# EAGLE design Callisto_MSO_Teknic_4BPico (EAGLE 9.6.2)
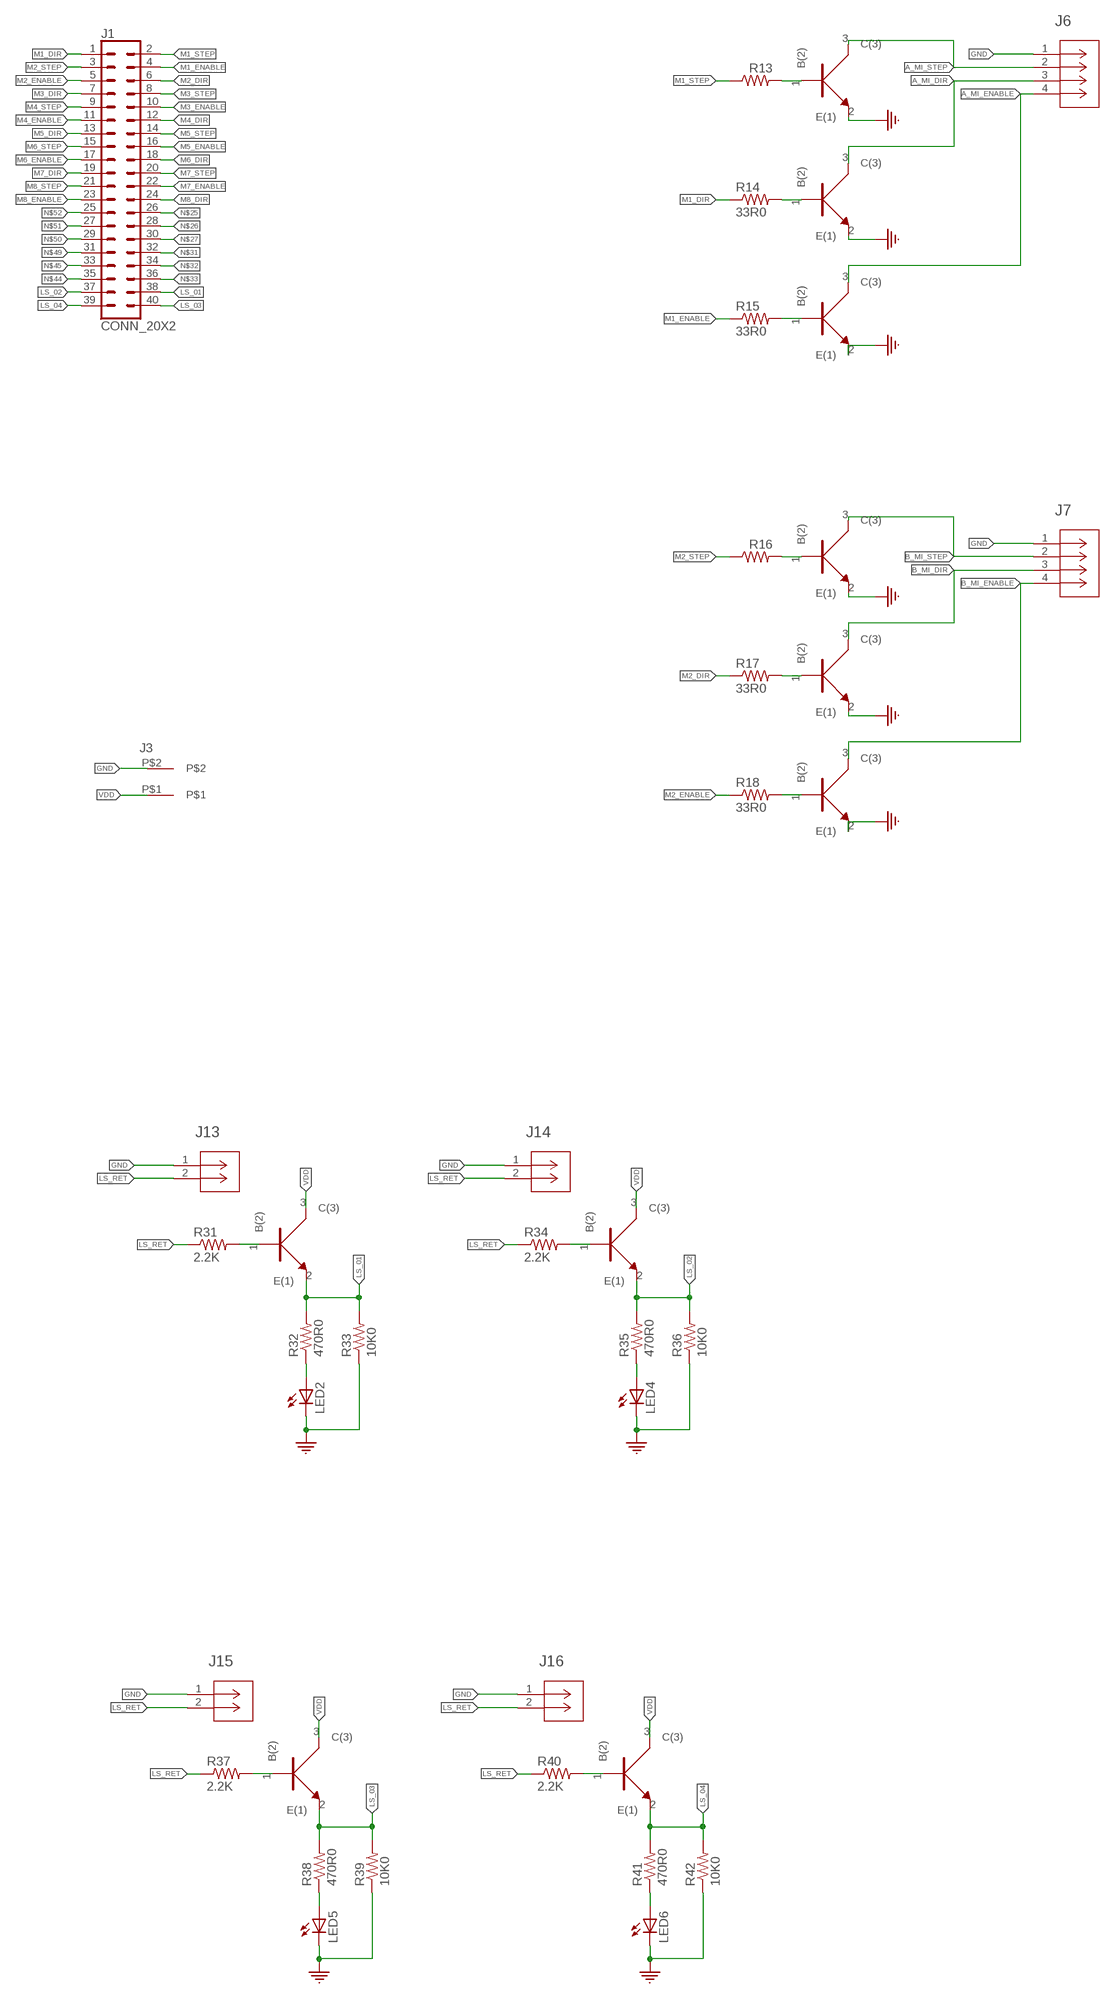
[diagram p0: schematic, sheet 1, part 1 of 2]
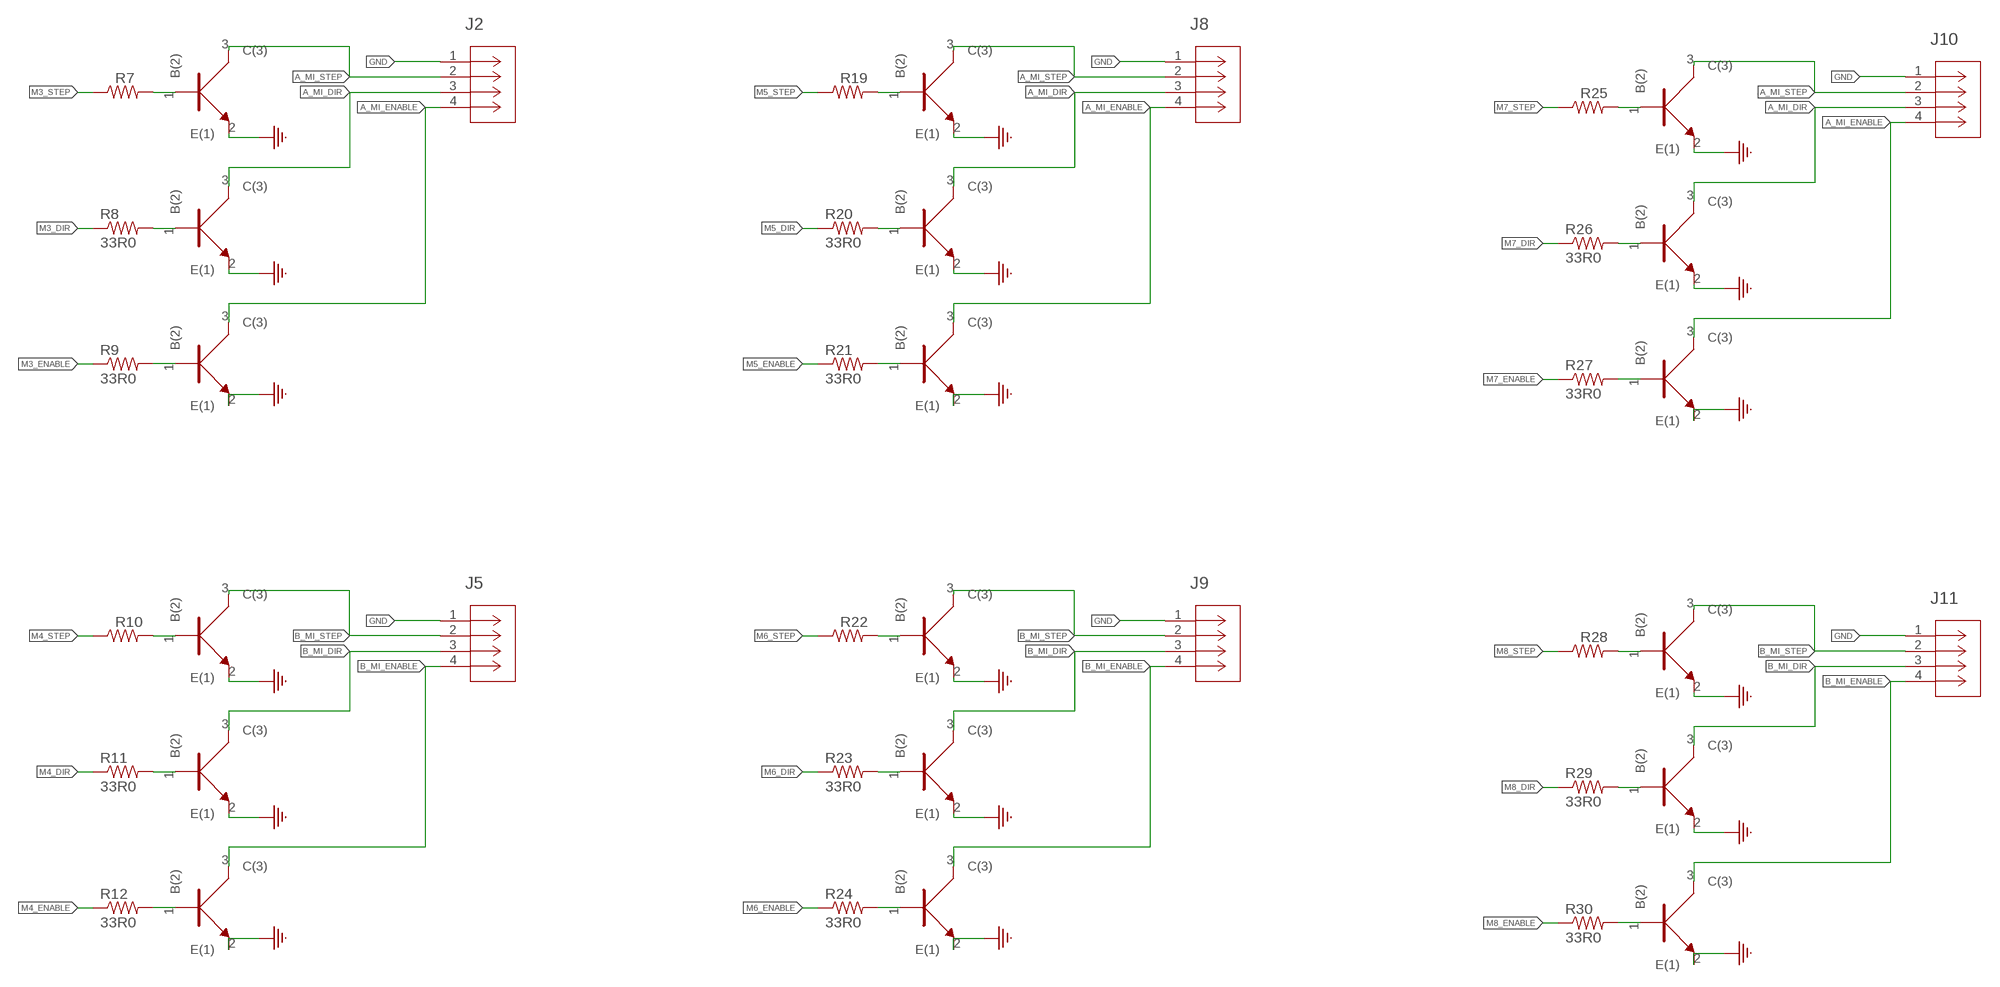
[diagram p1: schematic, sheet 1, part 2 of 2]

## Parts
J1  CONN_20X2  [2X20]
J2  CONN_530470410_PICOBLADE_X_4  [CON_530470410_MOL]
J3  2-pos  3.81MM_1_X_2_RT_ANGLE_PLUG_HEADER  [2_3.81MM_PITCH]
J5  CONN_530470410_PICOBLADE_X_4  [CON_530470410_MOL]
J6  CONN_530470410_PICOBLADE_X_4  [CON_530470410_MOL]
J7  CONN_530470410_PICOBLADE_X_4  [CON_530470410_MOL]
J8  CONN_530470410_PICOBLADE_X_4  [CON_530470410_MOL]
J9  CONN_530470410_PICOBLADE_X_4  [CON_530470410_MOL]
J10  CONN_530470410_PICOBLADE_X_4  [CON_530470410_MOL]
J11  CONN_530470410_PICOBLADE_X_4  [CON_530470410_MOL]
J13  CONN_530470210_PICOBLADE_X_2  [CON_530470210_MOL]
J14  CONN_530470210_PICOBLADE_X_2  [CON_530470210_MOL]
J15  CONN_530470210_PICOBLADE_X_2  [CON_530470210_MOL]
J16  CONN_530470210_PICOBLADE_X_2  [CON_530470210_MOL]
LED2  Green  LED_0805_GREEN  [0805]
LED4  Green  LED_0805_GREEN  [0805]
LED5  Green  LED_0805_GREEN  [0805]
LED6  Green  LED_0805_GREEN  [0805]
R7  33R0  R_0402_33R0  [0402]
R8  33R0  R_0402_33R0  [0402]
R9  33R0  R_0402_33R0  [0402]
R10  33R0  R_0402_33R0  [0402]
R11  33R0  R_0402_33R0  [0402]
R12  33R0  R_0402_33R0  [0402]
R13  33R0  R_0402_33R0  [0402]
R14  33R0  R_0402_33R0  [0402]
R15  33R0  R_0402_33R0  [0402]
R16  33R0  R_0402_33R0  [0402]
R17  33R0  R_0402_33R0  [0402]
R18  33R0  R_0402_33R0  [0402]
R19  33R0  R_0402_33R0  [0402]
R20  33R0  R_0402_33R0  [0402]
R21  33R0  R_0402_33R0  [0402]
R22  33R0  R_0402_33R0  [0402]
R23  33R0  R_0402_33R0  [0402]
R24  33R0  R_0402_33R0  [0402]
R25  33R0  R_0402_33R0  [0402]
R26  33R0  R_0402_33R0  [0402]
R27  33R0  R_0402_33R0  [0402]
R28  33R0  R_0402_33R0  [0402]
R29  33R0  R_0402_33R0  [0402]
R30  33R0  R_0402_33R0  [0402]
R31  2.2K  R_0402  [0402]
R32  470R0  R_0402_470R0  [0402]
R33  10K0  R_0402_10K0  [0402]
R34  2.2K  R_0402  [0402]
R35  470R0  R_0402_470R0  [0402]
R36  10K0  R_0402_10K0  [0402]
R37  2.2K  R_0402  [0402]
R38  470R0  R_0402_470R0  [0402]
R39  10K0  R_0402_10K0  [0402]
R40  2.2K  R_0402  [0402]
R41  470R0  R_0402_470R0  [0402]
R42  10K0  R_0402_10K0  [0402]
U2  NPN  BC846BW  [SOT323]
U4  NPN  BC846BW  [SOT323]
U5  NPN  BC846BW  [SOT323]
U6  NPN  BC846BW  [SOT323]
U7  NPN  BC846BW  [SOT323]
U8  NPN  BC846BW  [SOT323]
U9  NPN  BC846BW  [SOT323]
U10  NPN  BC846BW  [SOT323]
U11  NPN  BC846BW  [SOT323]
U12  NPN  BC846BW  [SOT323]
U13  NPN  BC846BW  [SOT323]
U14  NPN  BC846BW  [SOT323]
U15  NPN  BC846BW  [SOT323]
U16  NPN  BC846BW  [SOT323]
U17  NPN  BC846BW  [SOT323]
U18  NPN  BC846BW  [SOT323]
U19  NPN  BC846BW  [SOT323]
U20  NPN  BC846BW  [SOT323]
U21  NPN  BC846BW  [SOT323]
U22  NPN  BC846BW  [SOT323]
U23  NPN  BC846BW  [SOT323]
U24  NPN  BC846BW  [SOT323]
U25  NPN  BC846BW  [SOT323]
U26  NPN  BC846BW  [SOT323]
U27  NPN  BC846BW  [SOT323]
U28  NPN  BC846BW  [SOT323]
U29  NPN  BC846BW  [SOT323]
U30  NPN  BC846BW  [SOT323]

## Nets
A_MI_DIR: J2.3 J6.3 J8.3 J10.3 U8.3(C(3)) U14.3(C(3)) U20.3(C(3)) U26.3(C(3))
A_MI_ENABLE: J2.4 J6.4 J8.4 J10.4 U9.3(C(3)) U15.3(C(3)) U21.3(C(3)) U27.3(C(3))
A_MI_STEP: J2.2 J6.2 J8.2 J10.2 U7.3(C(3)) U13.3(C(3)) U19.3(C(3)) U25.3(C(3))
B_MI_DIR: J5.3 J7.3 J9.3 J11.3 U11.3(C(3)) U17.3(C(3)) U23.3(C(3)) U29.3(C(3))
B_MI_ENABLE: J5.4 J7.4 J9.4 J11.4 U12.3(C(3)) U18.3(C(3)) U24.3(C(3)) U30.3(C(3))
B_MI_STEP: J5.2 J7.2 J9.2 J11.2 U10.3(C(3)) U16.3(C(3)) U22.3(C(3)) U28.3(C(3))
GND: J2.1 J3.P$2 J5.1 J6.1 J7.1 J8.1 J9.1 J10.1 J11.1 J13.1 J14.1 J15.1 J16.1 LED2.2(C) LED4.2(C) LED5.2(C) LED6.2(C) R33.P$1 R36.P$1 R39.P$1 R42.P$1 U7.2(E(1)) U8.2(E(1)) U9.2(E(1)) U10.2(E(1)) U11.2(E(1)) U12.2(E(1)) U13.2(E(1)) U14.2(E(1)) U15.2(E(1)) U16.2(E(1)) U17.2(E(1)) U18.2(E(1)) U19.2(E(1)) U20.2(E(1)) U21.2(E(1)) U22.2(E(1)) U23.2(E(1)) U24.2(E(1)) U25.2(E(1)) U26.2(E(1)) U27.2(E(1)) U28.2(E(1)) U29.2(E(1)) U30.2(E(1))
LS_01: J1.38 R32.P$2 R33.P$2 U2.2(E(1))
LS_02: J1.37 R35.P$2 R36.P$2 U4.2(E(1))
LS_03: J1.40 R38.P$2 R39.P$2 U5.2(E(1))
LS_04: J1.39 R41.P$2 R42.P$2 U6.2(E(1))
LS_RET: J13.2 J14.2 J15.2 J16.2 R31.P$1 R34.P$1 R37.P$1 R40.P$1
M1_DIR: J1.1 R14.P$1
M1_ENABLE: J1.4 R15.P$1
M1_STEP: J1.2 R13.P$1
M2_DIR: J1.6 R17.P$1
M2_ENABLE: J1.5 R18.P$1
M2_STEP: J1.3 R16.P$1
M3_DIR: J1.7 R8.P$1
M3_ENABLE: J1.10 R9.P$1
M3_STEP: J1.8 R7.P$1
M4_DIR: J1.12 R11.P$1
M4_ENABLE: J1.11 R12.P$1
M4_STEP: J1.9 R10.P$1
M5_DIR: J1.13 R20.P$1
M5_ENABLE: J1.16 R21.P$1
M5_STEP: J1.14 R19.P$1
M6_DIR: J1.18 R23.P$1
M6_ENABLE: J1.17 R24.P$1
M6_STEP: J1.15 R22.P$1
M7_DIR: J1.19 R26.P$1
M7_ENABLE: J1.22 R27.P$1
M7_STEP: J1.20 R25.P$1
M8_DIR: J1.24 R29.P$1
M8_ENABLE: J1.23 R30.P$1
M8_STEP: J1.21 R28.P$1
N$3: R8.P$2 U8.1(B(2))
N$5: R9.P$2 U9.1(B(2))
N$6: R7.P$2 U7.1(B(2))
N$8: R31.P$2 U2.1(B(2))
N$9: LED2.1(A) R32.P$1
N$10: R11.P$2 U11.1(B(2))
N$11: R12.P$2 U12.1(B(2))
N$12: R10.P$2 U10.1(B(2))
N$13: R14.P$2 U14.1(B(2))
N$14: R15.P$2 U15.1(B(2))
N$15: R13.P$2 U13.1(B(2))
N$16: R17.P$2 U17.1(B(2))
N$17: R18.P$2 U18.1(B(2))
N$18: R16.P$2 U16.1(B(2))
N$19: R20.P$2 U20.1(B(2))
N$20: R21.P$2 U21.1(B(2))
N$21: R19.P$2 U19.1(B(2))
N$22: R23.P$2 U23.1(B(2))
N$23: R24.P$2 U24.1(B(2))
N$24: R22.P$2 U22.1(B(2))
N$25: J1.26
N$26: J1.28
N$27: J1.30
N$28: R26.P$2 U26.1(B(2))
N$29: R27.P$2 U27.1(B(2))
N$30: R25.P$2 U25.1(B(2))
N$31: J1.32
N$32: J1.34
N$33: J1.36
N$34: R29.P$2 U29.1(B(2))
N$35: R30.P$2 U30.1(B(2))
N$36: R28.P$2 U28.1(B(2))
N$40: R34.P$2 U4.1(B(2))
N$41: LED4.1(A) R35.P$1
N$42: R37.P$2 U5.1(B(2))
N$44: J1.35
N$45: J1.33
N$46: LED5.1(A) R38.P$1
N$47: R40.P$2 U6.1(B(2))
N$48: LED6.1(A) R41.P$1
N$49: J1.31
N$50: J1.29
N$51: J1.27
N$52: J1.25
VDD: J3.P$1 U2.3(C(3)) U4.3(C(3)) U5.3(C(3)) U6.3(C(3))

## Library data of the parts
J1 = 3D_MIG_Controller:CONN_20X2: Multi connection point. Often used as Generic Header-pin footprint for 0.1 inch spaced/style header connections On any of the 0.1 inch spaced packages, you can populate with these: Break Away Headers - Straight <https://www.sparkfun.com/products/116> (PRT-00116) Break Away Male Headers - Right Angle <https://www.sparkfun.com/products/553> (PRT-00553) Female Headers <https://www.sparkfun.com/products/115> (PRT-00115) Break Away Headers - Machine Pin <https://www.sparkfun.com/products/117> (PRT-00117) Break Away Female Headers - Swiss Machine Pin <https://www.sparkfun.com/products/743> (PRT-00743)
J2 J5-J11 = 3D_MIG_Controller:CONN_530470410_PICOBLADE_X_4; COPYRIGHT: Copyright (C) 2022 Ultra Librarian. All rights reserved.; MANUFACTURER_PART_NUMBER: 530470410; MFR_NAME: Molex Connector Corporation
J3 = 3D_MIG_Controller:3.81MM_1_X_2_RT_ANGLE_PLUG_HEADER: TERM BLOCK HDR 2POS 90DEG 3.81MM; PARTNO: 691322310002
J13-J16 = 3D_MIG_Controller:CONN_530470210_PICOBLADE_X_2; COPYRIGHT: Copyright (C) 2022 Ultra Librarian. All rights reserved.; MANUFACTURER_PART_NUMBER: 530470210; MFR_NAME: Molex Connector Corporation
LED2 LED4-LED6 = 3D_MIG_Controller:LED_0805_GREEN: Green 570nm LED Indication - Discrete 2.2V 0805 (2012 Metric); PARTNO: LG R971-KN-1
R7-R30 = 3D_MIG_Controller:R_0402_33R0; PARTNO: RMCF0402JT33R0
R31 R34 R37 R40 = 3D_MIG_Controller:R_0402
R32 R35 R38 R41 = 3D_MIG_Controller:R_0402_470R0; PARTNO: RMCF0402JT470R
R33 R36 R39 R42 = 3D_MIG_Controller:R_0402_10K0; PARTNO: RMCF0402JT10K0
U2 U4-U30 = 3D_MIG_Controller:BC846BW: Bipolar (BJT) Transistor NPN 100MHz Surface Mount SOT-323; PARTNO: BC846BW_NPN

## Board
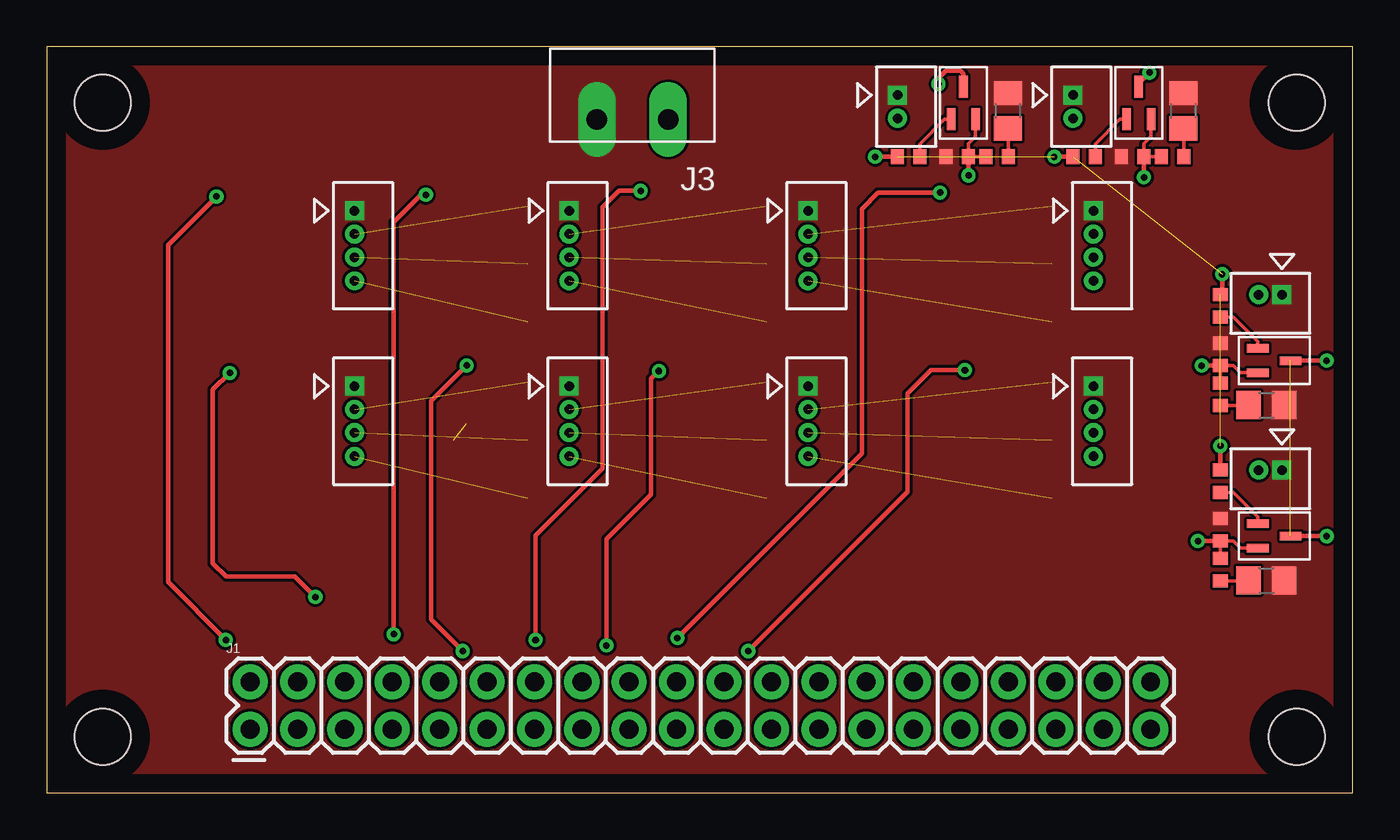
[diagram p2: board, top side]
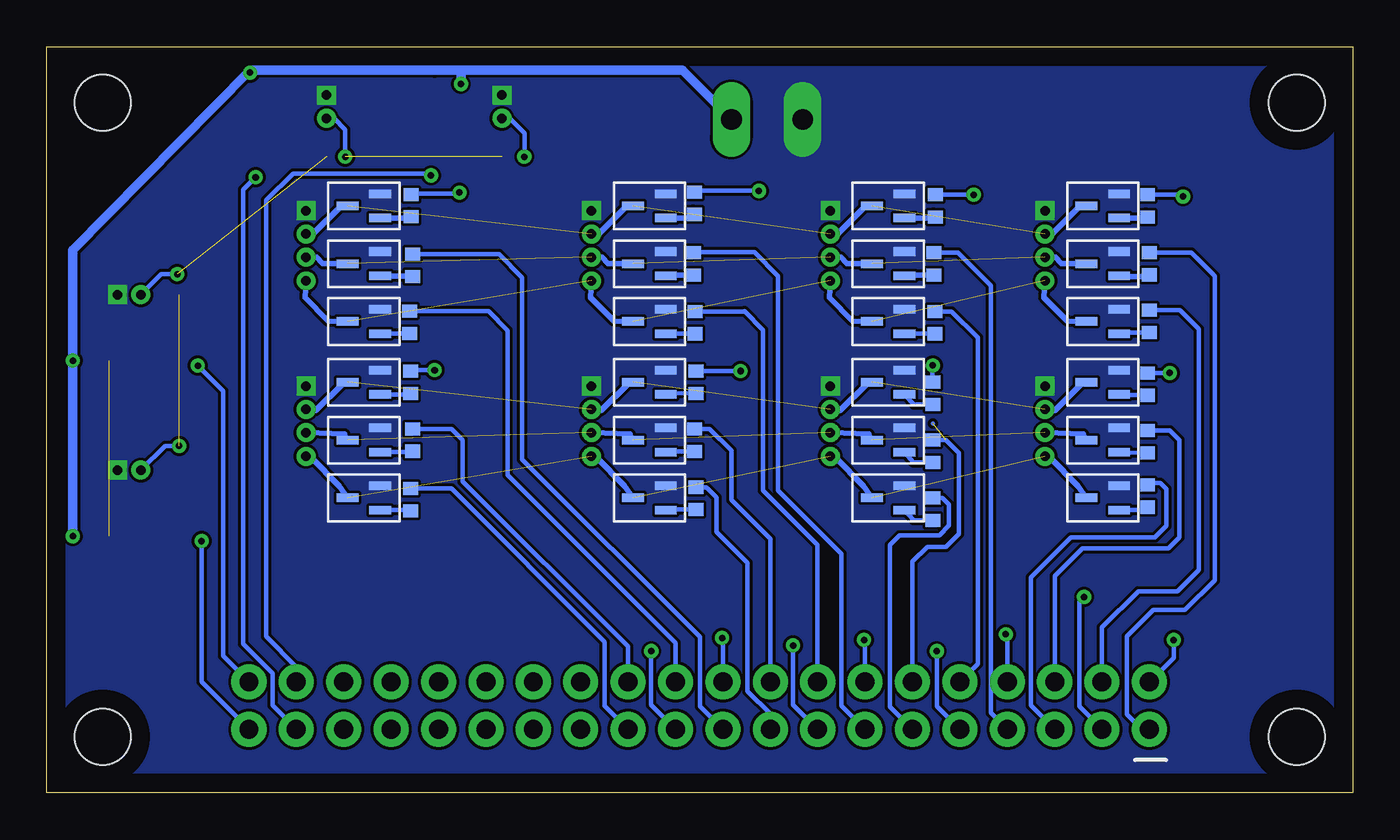
[diagram p3: board, bottom side, seen from below]

Size 70 x 40 mm. Coordinates in mm from the lower left corner, seen from the top.
Outline: 0,0 70,0 70,40 0,40 0,0
Copper layers (1*16): Top 0.035mm / dielectric 1.5mm / Bottom 0.035mm
Design rules "default": minimum track width 6mil, minimum drill 0.35mm, track to track 6mil, track to pad 6mil, pad to pad 6mil, via to via 6mil, smd to smd 6mil, copper to edge 40mil, drill to drill 6mil, minimum pad ring 10mil, minimum via ring 8mil, stop-mask expansion 4mil, vias tented up to drill 0mil, thermal gap 10mil
Holes 3 mm at 3,37 67,37 67,3 3,3

### Footprints (pad centres in the part's own frame; a part is rotated, then mirrored left to right if it is on the bottom)
2X20 = drill 1.016 pad 1.88: 1 0,0; 2 0,2.54; 3 2.54,0; 4 2.54,2.54; 5 5.08,0; 6 5.08,2.54; 7 7.62,0; 8 7.62,2.54; 9 10.16,0; 10 10.16,2.54; 11 12.7,0; 12 12.7,2.54; 13 15.24,0; 14 15.24,2.54; 15 17.78,0; 16 17.78,2.54; 17 20.32,0; 18 20.32,2.54; 19 22.86,0; 20 22.86,2.54; 21 25.4,0; 22 25.4,2.54; 23 27.94,0; 24 27.94,2.54; 25 30.48,0; 26 30.48,2.54; 27 33.02,0; 28 33.02,2.54; 29 35.56,0; 30 35.56,2.54; 31 38.1,0; 32 38.1,2.54; 33 40.64,0; 34 40.64,2.54; 35 43.18,0; 36 43.18,2.54; 37 45.72,0; 38 45.72,2.54; 39 48.26,0; 40 48.26,2.54
CON_530470410_MOL = drill 0.508 pad 0.838 square: 1 0,0 | drill 0.508 pad 0.838: 2 -1.245,0; 3 -2.489,0; 4 -3.759,0
2_3.81MM_PITCH = drill 1.1 pad 2 long: P$1 0,0; P$2 3.81,0
CON_530470210_MOL = drill 0.508 pad 0.838 square: 1 0,0 | drill 0.508 pad 0.838: 2 -1.245,0
0805 = smd 1.3 x 1.5: 1 -0.95,0; 2 0.95,0
0402 = smd 0.8 x 0.7: P$1 0,0.6; P$2 0,-0.6
SOT323 = smd 0.457 x 1.168: 1 -0.65,-0.876; 2 0.65,-0.876; 3 0,0.876

### Placement (x,y rotation side)
J1  10.9,3.41 0 top
J2  28,31.21 90 top
J3  33.3,36.1 180 top
J5  28,21.8 90 top
J6  16.5,31.21 90 top
J7  16.5,21.8 90 top
J8  40.8,31.21 90 top
J9  40.8,21.8 90 top
J10  56.1,31.21 90 top
J11  56.1,21.8 90 top
J13  45.6,37.4 90 top
J14  55,37.4 90 top
J15  66.2,26.7 0 top
J16  66.2,17.3 0 top
LED2  51.52,36.56 90 top
LED4  60.92,36.56 90 top
LED5  65.36,20.78 0 top
LED6  65.36,11.38 0 top
R7  22.37,31.46 0 bottom
R8  22.45,28.36 0 bottom
R9  22.4,25.21 0 bottom
R10  22.5,21.41 0 bottom
R11  22.5,18.31 0 bottom
R12  22.5,15.21 0 bottom
R13  11,31.47 0 bottom
R14  10.9,28.37 0 bottom
R15  10.9,25.27 0 bottom
R16  11,21.91 0 bottom
R17  11,18.82 0 bottom
R18  11,15.91 0 bottom
R19  35.27,31.61 0 bottom
R20  35.33,28.35 0 bottom
R21  35.25,25.21 0 bottom
R22  35.2,22.01 0 bottom
R23  35.28,18.9 0 bottom
R24  35.2,15.78 0 bottom
R25  50.48,31.48 0 bottom
R26  50.4,28.27 0 bottom
R27  50.56,25.22 0 bottom
R28  50.5,22.01 0 bottom
R29  50.4,18.91 0 bottom
R30  50.5,15.71 0 bottom
R31  46.2,34.1 90 top
R32  50.94,34.1 270 top
R33  48.8,34.1 90 top
R34  55.6,34.1 90 top
R35  60.34,34.1 270 top
R36  58.2,34.1 90 top
R37  62.9,26.1 0 top
R38  62.9,21.36 180 top
R39  62.9,23.5 0 top
R40  62.9,16.7 0 top
R41  62.9,11.96 180 top
R42  62.9,14.1 0 top
U2  49.13,36.98 0 top
U4  58.53,36.98 0 top
U5  65.78,23.17 270 top
U6  65.78,13.77 270 top
U7  24.9,31.46 90 bottom
U8  24.9,28.36 90 bottom
U9  24.9,25.26 90 bottom
U10  24.9,22.01 90 bottom
U11  24.9,18.91 90 bottom
U12  24.9,15.81 90 bottom
U13  13.4,31.46 90 bottom
U14  13.4,28.36 90 bottom
U15  13.4,25.26 90 bottom
U16  13.4,22.01 90 bottom
U17  13.4,18.91 90 bottom
U18  13.4,15.81 90 bottom
U19  37.7,31.46 90 bottom
U20  37.7,28.36 90 bottom
U21  37.7,25.26 90 bottom
U22  37.7,22.01 90 bottom
U23  37.7,18.91 90 bottom
U24  37.7,15.81 90 bottom
U25  53,31.46 90 bottom
U26  53,28.36 90 bottom
U27  53,25.26 90 bottom
U28  53,22.01 90 bottom
U29  53,18.91 90 bottom
U30  53,15.81 90 bottom

### Tracks (layer width: path | path; a pad name or v marks a point on that pad's centre or on a via)
A_MI_DIR  (3 unrouted)
  Bottom 0.305: J6.3 15.94,28.71 15.61,28.38 U14.3 | J2.3 27.44,28.71 27.11,28.38 U8.3 | J8.3 40.24,28.71 39.91,28.38 U20.3 | J10.3 55.54,28.71 55.21,28.38 U26.3
A_MI_ENABLE  (3 unrouted)
  Bottom 0.305: J6.4 16.56,26.55 15.3,25.28 U15.3 | J2.4 28.06,26.55 26.8,25.28 U9.3 | J8.4 40.86,26.55 39.6,25.28 U21.3 | J10.4 56.16,26.55 54.91,25.28 U27.3
A_MI_STEP  (3 unrouted)
  Bottom 0.305: J6.2 16.13,29.96 14.6,31.47 U13.3 | J2.2 27.63,29.96 26.1,31.47 U7.3 | J8.2 40.43,29.96 38.9,31.47 U19.3 | J10.2 55.73,29.96 54.2,31.47 U25.3
B_MI_DIR  (3 unrouted)
  Bottom 0.305: U17.3 14.44,19.25 J7.3 | U11.3 25.94,19.25 J5.3 | U23.3 38.74,19.25 J9.3 | U29.3 54.04,19.25 J11.3
B_MI_ENABLE  (3 unrouted)
  Bottom 0.305: J7.4 16.24,17.99 14.73,16.46 U18.3 | J5.4 27.74,17.99 26.23,16.46 U12.3 | J9.4 40.54,17.99 39.03,16.46 U24.3 | J11.4 55.84,17.99 54.33,16.46 U30.3
B_MI_STEP  (3 unrouted)
  Bottom 0.305: J7.2 15.98,20.5 14.54,21.92 U16.3 | J5.2 27.48,20.5 26.04,21.92 U10.3 | J9.2 40.28,20.5 38.84,21.92 U22.3 | J11.2 55.58,20.5 54.14,21.92 U28.3
GND
  pour Top (no thermals): 0,40.1 70,40.1 70,0 0,0
  pour Bottom (no thermals): 0,40.1 70,40.1 70,0 0,0
LS_01  (via drill 0.35)
  Top 0.2: R33.P$2 49.58,34.28 49.6,34.28 | R33.P$2 R32.P$2 | R33.P$2 49.4,34.8 49.78,35.18 U2.2
  Top 0.254: v49.4,33.1 R33.P$2
  Bottom 0.254: J1.38 56.62,6.76 58.24,8.38 58.24,31.76 56.8,33.2 49.5,33.2 v49.4,33.1
LS_02  (via drill 0.35)
  Top 0.2: R36.P$2 58.98,34.28 59,34.28 | R36.P$2 R35.P$2 | R36.P$2 58.8,34.8 59.18,35.18 U4.2
  Top 0.254: v58.8,33 R36.P$2
  Bottom 0.254: J1.37 57.9,4.69 57.9,6.42 59.47,7.98 59.47,32.34 v58.81,33 v58.8,33
LS_03  (via drill 0.35)
  Top 0.2: R39.P$2 63.08,22.72 63.08,22.7 | R39.P$2 R38.P$2 | R39.P$2 63.6,22.9 63.98,22.52 U5.2
  Top 0.254: v61.9,22.9 R39.P$2
  Bottom 0.254: J1.40 60.55,7.34 60.55,21.55 v61.9,22.9
LS_04  (via drill 0.35)
  Top 0.2: R42.P$2 63.08,13.32 63.08,13.3 | R42.P$2 R41.P$2 | R42.P$2 63.6,13.5 63.98,13.12 U6.2
  Top 0.254: v61.7,13.5 R42.P$2
  Bottom 0.254: J1.39 61.7,5.95 v61.7,13.5
LS_RET  (via drill 0.35)  (3 unrouted)
  Top 0.2: R31.P$1 45.6,34.21 | R34.P$1 55,34.21 | R37.P$1 63.01,26.7 | R40.P$1 63.01,17.3
  Top 0.254: R37.P$1 63,26.8 v63,27.8 | v62.9,18.6 R40.P$1 | R34.P$1 v54,34.1 | v44.4,34.1 R31.P$1
  Bottom 0.254: v63,27.8 63.85,27.8 J15.2 | J16.2 63.66,18.6 v62.9,18.6 | v54,34.1 54,35.55 54.6,36.16 J14.2 | J13.2 45.2,36.16 44.4,35.35 v44.4,34.1
M1_DIR
  Bottom 0.254: R14.P$1 | R14.P$1 8.67,28.97 7.4,27.7 7.4,11.4 9,9.8 10.7,9.8 12.12,8.38 12.12,5.45 12.1,5.43 12.1,4.2 11.31,3.41 J1.1
M1_ENABLE
  Bottom 0.254: R15.P$1 | R15.P$1 9.27,25.87 8.25,24.85 8.25,11.95 9.4,10.8 11.5,10.8 13.44,8.86 J1.4
M1_STEP  (via drill 0.35)
  Top 0.254: v9.1,31.97 6.5,29.37 6.5,11.3 v9.6,8.2
  Bottom 0.254: R13.P$1 | R13.P$1 9.2,32.07 v9.1,31.97 | v9.6,8.2 9.6,7.25 J1.2
M2_DIR
  Bottom 0.254: R17.P$1 9.8,19.42 9.3,18.92 9.3,13.7 9.9,13.1 14.5,13.1 15.98,11.62 J1.6
M2_ENABLE
  Bottom 0.254: R18.P$1 11,16.61 10.31,16.61 10,16.3 10,14.3 10.6,13.7 15.1,13.7 17.26,11.54 17.26,4.69 J1.5
M2_STEP  (via drill 0.35)
  Top 0.254: v14.4,10.5 13.3,11.6 9.62,11.6 8.91,12.31 8.91,21.61 v9.81,22.51
  Bottom 0.254: R16.P$1 v9.81,22.51 | J1.3 13.44,3.43 14.66,4.64 14.66,10.24 v14.4,10.5
M3_DIR
  Bottom 0.254: R8.P$1 21.16,28.96 19.4,27.2 19.4,4.29 J1.7
M3_ENABLE
  Bottom 0.254: R9.P$1 21.51,25.81 20.1,24.4 20.1,6.91 J1.10
M3_STEP  (via drill 0.35)
  Top 0.254: v18.6,8.5 18.6,30.6 20.06,32.06 v20.32,32.06
  Bottom 0.254: R7.P$1 | R7.P$1 v20.32,32.06 | J1.8 18.52,8.42 v18.6,8.5
M4_DIR  (1 unrouted)
  Bottom 0.254: R11.P$1 21.8,18.91 21.1,18.21 21.1,13.89 21.8,13.19 22.81,13.19 23.6,12.4 J1.12 | 22.5,19.81
M4_ENABLE
  Bottom 0.254: R12.P$1 22,15.81 21.64,15.45 21.64,14.33 22.17,13.8 24.3,13.8 24.82,13.28 24.82,5.45 24.8,5.43 24.8,4.61 J1.11
M4_STEP  (via drill 0.35)
  Top 0.254: v22.3,7.6 20.6,9.3 20.6,21 v22.51,22.91
  Bottom 0.254: R10.P$1 22.55,22.98 v22.51,22.91 | J1.9 22.3,4.65 v22.3,7.6
M5_DIR
  Bottom 0.254: R20.P$1 35.34,28.98 32.08,28.98 30.8,27.7 30.8,16.2 27.4,12.8 27.4,4.67 J1.13
M5_ENABLE
  Bottom 0.254: R21.P$1 32.61,25.81 32.61,25.82 31.6,24.81 31.6,16.2 28.68,13.28 J1.16
M5_STEP  (via drill 0.35)
  Top 0.254: v31.83,32.27 30.67,32.27 29.8,31.4 29.8,17.4 26.2,13.8 v26.2,8.2
  Bottom 0.254: R19.P$1 35.21,32.27 v31.83,32.27 | J1.14 26.14,8.14 v26.2,8.2
M6_DIR
  Bottom 0.254: J1.18 31.22,13.62 33.3,15.7 33.3,18.34 34.47,19.51 35.28,19.51 R23.P$1
M6_ENABLE
  Bottom 0.254: R24.P$1 34.64,16.38 34.1,15.84 34.1,14 32.44,12.34 32.44,5.45 31.22,4.23 J1.17
M6_STEP  (via drill 0.35)
  Top 0.254: v30,7.9 30,13.6 32.4,16 32.4,22.2 v32.81,22.61
  Bottom 0.254: R22.P$1 v32.81,22.61 | J1.15 30,4.73 v30,7.9
M7_DIR
  Bottom 0.254: J1.19 35,4.65 35,8.36 44.51,17.87 44.51,27.63 45.75,28.87 R26.P$1
M7_ENABLE
  Bottom 0.254: J1.22 36.3,8.05 45.29,17.04 45.29,24.78 46.33,25.82 R27.P$1
M7_STEP  (via drill 0.35)
  Top 0.254: v47.88,32.18 47.87,32.17 44.55,32.17 43.68,31.3 43.68,18.18 v33.8,8.3
  Bottom 0.254: R25.P$1 50.44,32.12 47.94,32.12 v47.88,32.18 | J1.20 33.76,8.26 v33.8,8.3
M8_DIR
  Bottom 0.254: J1.24 38.84,7.84 47.7,16.7 47.7,18.91 48.3,19.51 R29.P$1
M8_ENABLE
  Bottom 0.254: R30.P$1 48.31,16.31 40.1,8.1 40.1,4.67 J1.23
M8_STEP  (via drill 0.35)
  Top 0.254: v49.21,22.66 47.38,22.66 46.12,21.4 46.12,16.12 v37.6,7.6
  Bottom 0.254: R28.P$1 50.45,22.66 v49.21,22.66 | J1.21 37.6,4.71 v37.6,7.6
N$3
  Bottom 0.305: U8.1 23.98,27.76 R8.P$2
N$5
  Bottom 0.254: R9.P$2 U9.1
N$6
  Bottom 0.305: 22.47,31.08 R7.P$2 22.37,30.81 U7.1
N$8
  Top 0.2: U2.1 48.12,36.1 46.8,34.78 R31.P$2
N$9
  Top 0.2: LED2.1 51.54,35.59 R32.P$1
N$10
  Bottom 0.254: U11.1 23.55,17.72 R11.P$2
N$11
  Bottom 0.254: U12.1 23.56,14.62 R12.P$2
N$12
  Bottom 0.254: U10.1 23.52,20.82 R10.P$2
N$13
  Bottom 0.305: U14.1 12.48,27.67 11,27.67 R14.P$2
N$14
  Bottom 0.254: U15.1 12.46,24.68 R15.P$2
N$15
  Bottom 0.305: 11.1,31.09 R13.P$2 11,30.81 U13.1
N$16
  Bottom 0.254: U17.1 12.5,18.23 R17.P$2
N$17
  Bottom 0.254: U18.1 11.35,15.16 11.2,15.31 R18.P$2
N$18
  Bottom 0.254: U16.1 12.49,21.32 R16.P$2
N$19
  Bottom 0.305: U20.1 36.79,27.75 R20.P$2
N$20
  Bottom 0.254: U21.1 R21.P$2
N$21
  Bottom 0.305: 35.37,31.23 R19.P$2 35.27,30.81 U19.1
N$22
  Bottom 0.254: U23.1 36.77,18.31 R23.P$2
N$23
  Bottom 0.254: U24.1 36.79,15.19 R24.P$2
N$24
  Bottom 0.254: U22.1 36.76,21.42 R22.P$2
N$28
  Bottom 0.305: U26.1 50.32,27.71 50.37,27.67 R26.P$2
N$29
  Bottom 0.254: U27.1 52.11,24.63 R27.P$2
N$30
  Bottom 0.305: 50.58,31.1 R25.P$2 50.48,30.81 U25.1
N$34
  Bottom 0.254: U29.1 50.42,18.26 50.44,18.27 R29.P$2
N$35
  Bottom 0.254: U30.1 50.51,15.16 50.5,15.15 R30.P$2
N$36
  Bottom 0.254: R28.P$2 50.48,21.41 50.42,21.36 U28.1
N$40
  Top 0.2: U4.1 57.52,36.1 56.2,34.78 R34.P$2
N$41
  Top 0.2: LED4.1 60.94,35.59 R35.P$1
N$42
  Top 0.2: U5.1 64.9,24.18 63.58,25.5 R37.P$2
N$46
  Top 0.2: LED5.1 64.39,20.76 R38.P$1
N$47
  Top 0.2: U6.1 64.9,14.78 63.58,16.1 R40.P$2
N$48
  Top 0.2: LED6.1 64.39,11.36 R41.P$1
VDD  (via drill 0.35)  (1 unrouted)
  Top 0.254: v68.6,13.76 U6.3 | U5.3 v68.6,23.17 | U2.3 49.13,38.54 48.97,38.7 48.2,38.7 47.8,38.3 v47.8,38 | U4.3 58.53,38.04 v59.1,38.61
  Bottom 0.254: 49.2,38.61 49.2,38.73 | v59.1,38.61 59.1,38.73
  Bottom 0.508: J3.P$1 35.93,38.73 47.8,38.73 | v68.6,13.76 68.6,29.1 59.1,38.73 49.2,38.73 47.8,38.73 | v47.8,38 47.8,38.73